# EAGLE design pH_amp (EAGLE 5.11)
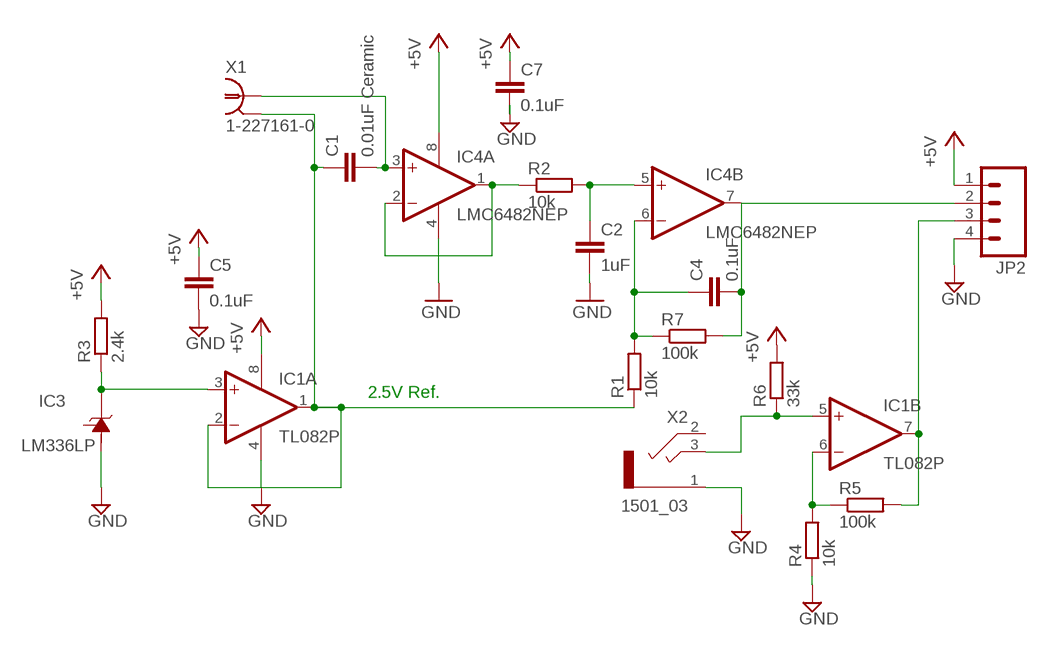
[diagram p0: schematic, sheet 1]

## Parts
C1  0.01uF Ceramic  C2.5/2  [C2.5-2]
C2  1uF  C2.5/2  [C2.5-2]
C4  0.1uF  C2.5/2  [C2.5-2]
C5  0.1uF  C2.5/2  [C2.5-2]
C7  0.1uF  C2.5/2  [C2.5-2]
IC1  TL082P  [DIL08]
IC3  LM336LP  [TO92]
IC4  LMC6482NEP  [DIL08]
JP2  M04POLAR  [MOLEX-1X4]
R1  10k  R-EU_0204/5  [0204/5]
R2  10k  R-EU_0204/5  [0204/5]
R3  2.4k  R-EU_0204/5  [0204/5]
R4  10k  R-EU_0204/5  [0204/5]
R5  100k  R-EU_0204/5  [0204/5]
R6  33k  R-EU_0204/5  [0204/5]
R7  100k  R-EU_0204/5  [0204/5]
X1  1-227161-0  [AMP_227161]
X2  1501_03  [1501_03]

## Nets
+5V: C5.1 C7.1 IC1.8(P:V+) IC4.8(P:V+) JP2.1 R3.2 R6.2
GND: C2.2 C5.2 C7.2 IC1.4(P:V-) IC3.3(-) IC4.4(P:V-) JP2.4 R4.1 X2.1
N$1: C2.1 IC4.5(B:+IN) R2.2
N$2: IC1.6(B:-IN) R4.2 R5.1
N$3: C4.1 IC4.6(B:-IN) R1.2 R7.1
N$4: IC1.3(A:+IN) IC3.2(+) R3.1
N$5: IC1.7(B:OUT) JP2.3 R5.2
N$7: C4.2 IC4.7(B:OUT) JP2.2 R7.2
N$8: C1.2 IC4.3(A:+IN) X1.1
N$11: IC1.5(B:+IN) R6.1 X2.3
N$12: IC4.1(A:OUT) IC4.2(A:-IN) R2.1
VREF: C1.1 IC1.1(A:OUT) IC1.2(A:-IN) R1.1 X1.2(GND)
Unconnected: IC3.1(ADJ) X2.2

## Notes on the sheet
- 2.5V Ref.

## Library data of the parts
C1 C2 C4 C5 C7 = capacitor-wima:C: CAPACITOR naming: grid - package width
IC1 = linear:TL082: OP AMP
IC3 = MyPartLibrary:LM336: 2.5V Reference Diode LM236 Source: http://focus.ti.com/lit/ds/symlink/lm336-2.5.pdf
IC4 = MyPartLibrary:LMC6482: CMOS Dual Operational Amplifier
JP2 = SparkFun:M04: Header 4 Standard 4-pin 0.1" header. Use with straight break away headers (SKU : PRT-00116), right angle break away headers (PRT-00553), swiss pins (PRT-00743), machine pins (PRT-00117), and female headers (PRT-00115). Molex polarized connector foot print use with SKU : PRT-08231 with associated crimp pins and housings.
R1-R7 = rcl:R-EU_: RESISTOR, European symbol
X1 = con-coax:?227161*: JACK, RIGHT ANGLE, 50 OHM, PCB, BNC Source: amp_227161.pdf; MF: TYCO ELECTRONICS; MPN: 1-227161; OC_FARNELL: unknown; OC_NEWARK: 33B3200
X2 = con-lumberg:1501_03: Klinkensteckverbinder nach JISC 6560, 2,5 mm Jack connectors according to JISC 6560, 2.5 mm Source: http://www.lumberg.com/Produkte/PDFs/1501_03.pdf; OC_FARNELL: 1200127; OC_NEWARK: unknown

## Board
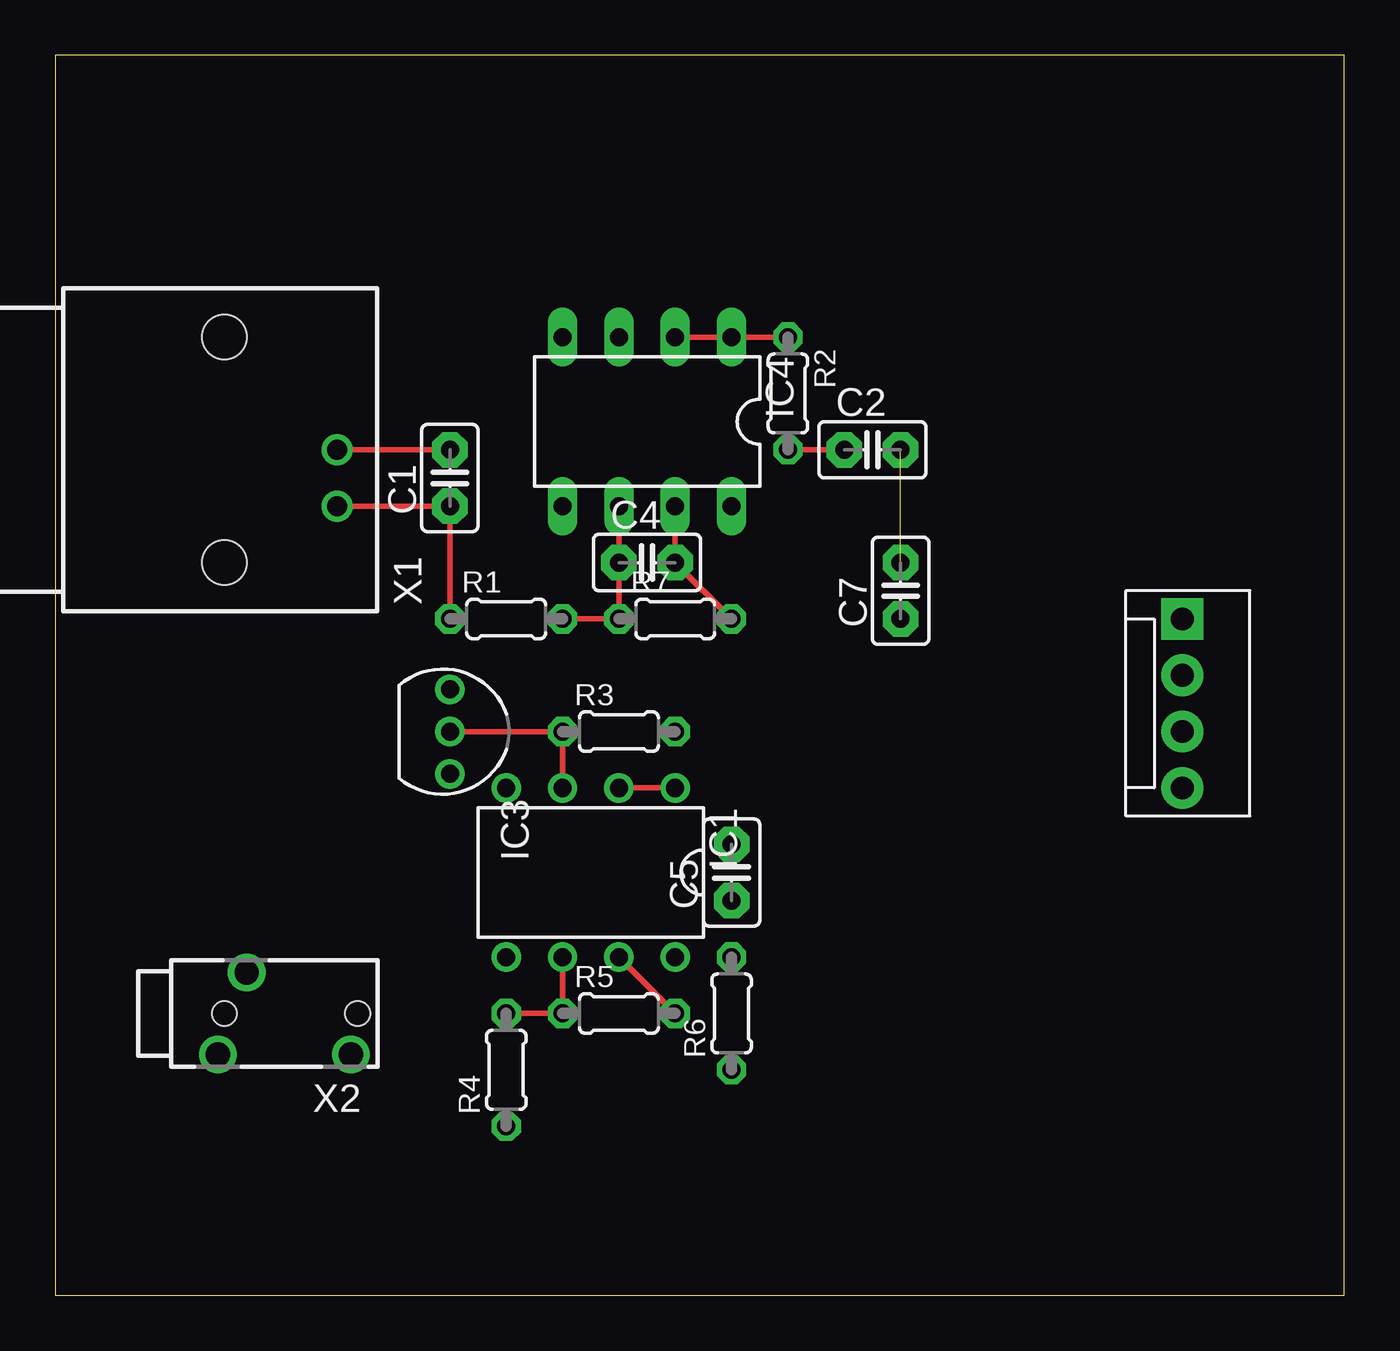
[diagram p1: board, top side]
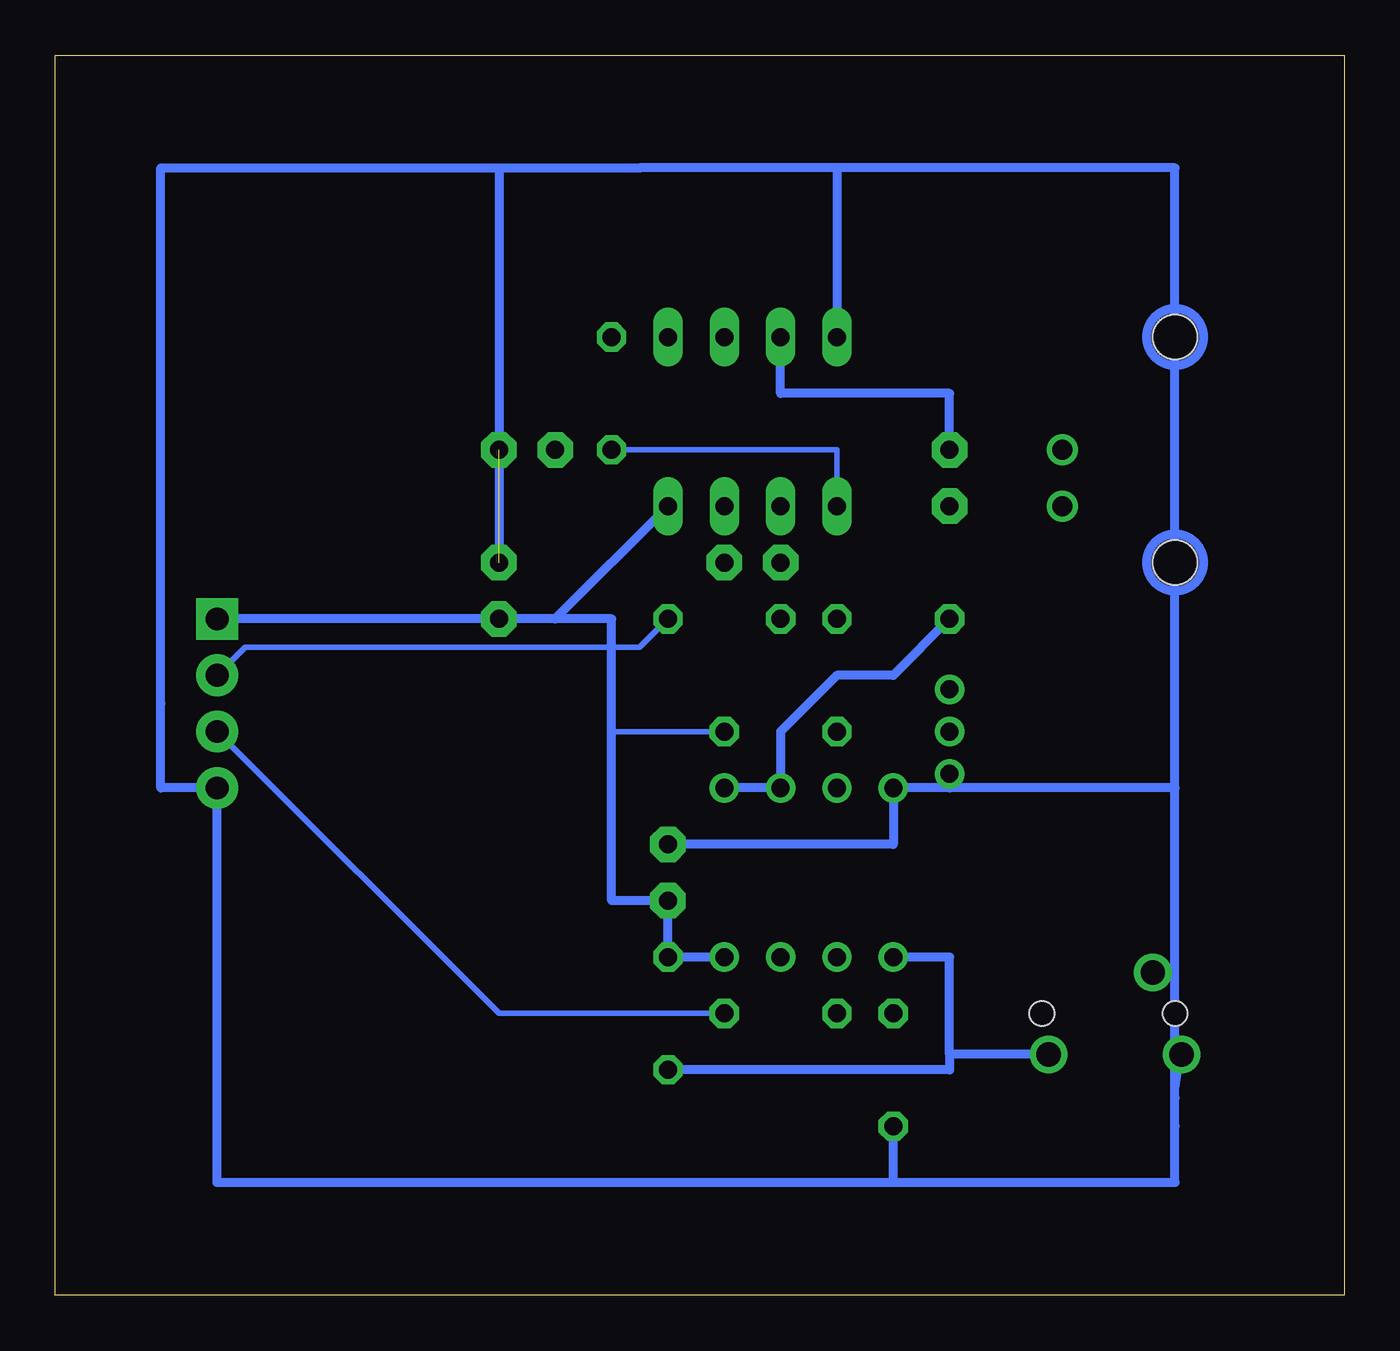
[diagram p2: board, bottom side, seen from below]

Size 58.09 x 55.87 mm. Coordinates in mm from the lower left corner, seen from the top.
Outline: 0,0 58.09,0 58.09,55.87 0,55.87 0,0
Copper layers (1*16): Top 0.035mm / dielectric 1.5mm / Bottom 0.035mm
Design rules "default": minimum track width 10mil, minimum drill 24mil, track to track 8mil, track to pad 8mil, pad to pad 8mil, via to via 8mil, smd to smd 8mil, copper to edge 40mil, drill to drill 8mil, minimum pad ring 10mil, minimum via ring 8mil, stop-mask expansion 4mil, vias tented up to drill 0mil, thermal gap 10mil

### Footprints (pad centres in the part's own frame; a part is rotated, then mirrored left to right if it is on the bottom)
C2.5-2 = drill 0.813 pad 1.6 octagon: 1 -1.27,0; 2 1.27,0
DIL08 = drill 0.813 pad 1.27 round: 1 -3.81,-3.81; 2 -1.27,-3.81; 3 1.27,-3.81; 4 3.81,-3.81; 5 3.81,3.81; 6 1.27,3.81; 7 -1.27,3.81; 8 -3.81,3.81
TO92 = drill 0.813 round: 1 -1.905,0; 2 0,0; 3 1.905,0
DIL08' = drill 0.813 long: 1 -3.81,-3.81; 2 -1.27,-3.81; 3 1.27,-3.81; 4 3.81,-3.81; 5 3.81,3.81; 6 1.27,3.81; 7 -1.27,3.81; 8 -3.81,3.81
MOLEX-1X4 = drill 1.016 pad 1.88 square: 1 0,0 | drill 1.016 pad 1.88 round: 2 2.54,0; 3 5.08,0; 4 7.62,0
0204/5 = drill 0.813 octagon: 1 -2.54,0; 2 2.54,0
AMP_227161 = drill 0.9 pad 1.27 round: 1 0,-5.08; 2 -2.54,-5.08 | hole 2: -5.08,0; 5.08,0
1501_03 = drill 1.1 pad 1.7 round: 1 -1.85,0.3; 2 1.85,-1; 3 -1.85,-5.7 | hole 1.1: 0,0; 0,-6

### Placement (x,y rotation side)
C1  17.78,36.83 90 top
C2  36.83,38.1 0 top
C4  26.67,33.02 0 top
C5  30.48,19.05 90 top
C7  38.1,31.75 90 top
IC1  24.13,19.05 180 top
IC3  17.78,25.4 270 top
IC4  LMC6482NEP  [DIL08']  26.67,39.37 180 top
JP2  50.8,30.48 270 top
R1  20.32,30.48 0 top
R2  33.02,40.64 270 top
R3  25.4,25.4 0 top
R4  20.32,10.16 90 top
R5  25.4,12.7 0 top
R6  30.48,12.7 90 top
R7  27.94,30.48 0 top
X1  7.62,38.1 90 top
X2  7.62,12.7 90 top

### Tracks (layer width: path | path; a pad name or v marks a point on that pad's centre or on a via)
+5V
  Bottom 0.254: 33.02,25.4 R3.2
  Bottom 0.406: JP2.1 C7.1 35.56,30.48 | 35.56,30.48 IC4.8 | 35.56,30.48 33.02,30.48 33.02,25.4 33.02,17.78 C5.1 R6.2 IC1.8
GND  (1 unrouted)
  Bottom 0.254: 7.62,7.62 7.62,8.89 X2.1
  Bottom 0.406: 20.32,5.08 7.62,5.08 7.62,7.62 7.62,8.89 7.62,22.86 | 20.32,5.08 50.8,5.08 JP2.4 53.34,22.86 53.34,26.67 53.34,50.8 52.07,50.8 38.1,50.8 | 7.62,22.86 7.62,31.75 7.62,41.91 7.62,44.45 7.62,50.8 22.86,50.8 | 38.1,50.8 31.75,50.8 22.86,50.8 | 7.62,22.86 17.78,22.86 | 17.78,22.86 IC1.4 20.32,20.32 C5.2 | 17.78,22.86 IC3.3 | 20.32,5.08 R4.1 | 22.86,50.8 IC4.4 | 38.1,50.8 C7.2
N$1
  Top 0.254: R2.2 C2.1
  Bottom 0.254: IC4.5 22.86,38.1 R2.2
N$2
  Top 0.254: IC1.6 R5.1 R4.2
N$3
  Top 0.254: IC4.6 C4.1 R7.1 R1.2
N$4
  Top 0.254: IC1.3 R3.1 IC3.2
N$5
  Top 0.254: IC1.7 R5.2
  Bottom 0.254: JP2.3 38.1,12.7 R5.2
N$7
  Top 0.254: IC4.7 C4.2 R7.2
  Bottom 0.254: JP2.2 49.53,29.21 31.75,29.21 R7.2
N$8
  Top 0.254: X1.1 C1.2
  Bottom 0.406: IC4.3 25.4,40.64 17.78,40.64 C1.2
N$11
  Bottom 0.406: X2.3 17.78,10.85 | 17.78,10.85 17.78,10.16 R6.1 | 17.78,10.85 17.78,15.24 IC1.5
N$12
  Top 0.254: IC4.2 IC4.1 R2.1
VREF
  Top 0.254: X1.2 C1.1 R1.1 | IC1.2 IC1.1
  Bottom 0.406: IC1.2 IC1.1 IC1.2 | IC1.2 25.4,25.4 22.86,27.94 20.32,27.94 R1.1
(copper drawn outside any net)
  shapes: Bottom circle x2